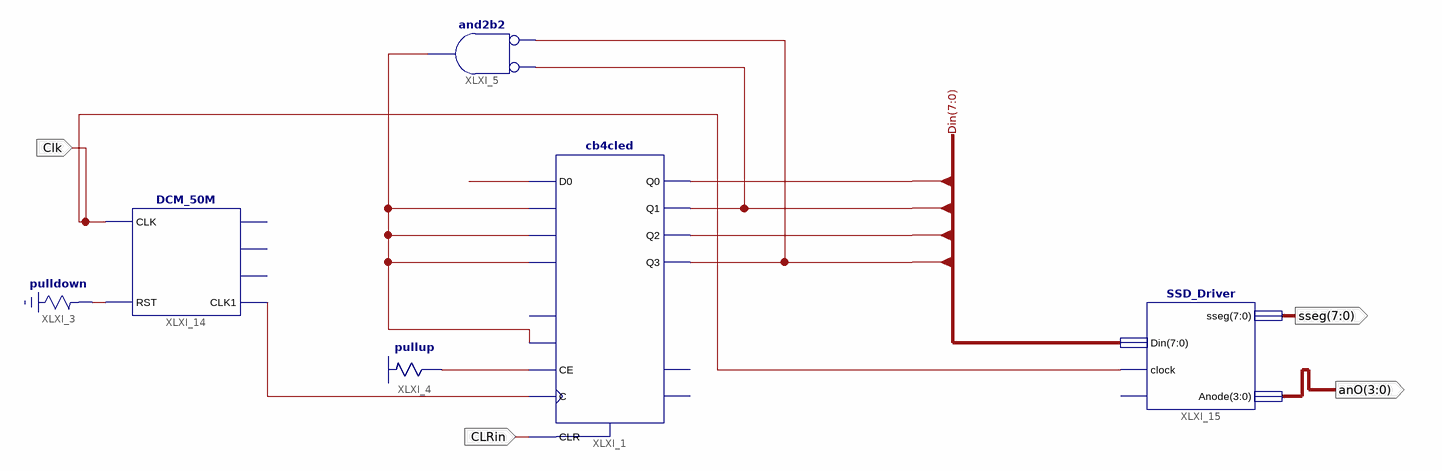
[diagram p0: schematic sheet 1]
// Xilinx ISE schematic Lab8_Experiment6.sch (spartan3e) as structural Verilog: 6 symbols, 4 ports
module Lab8_Experiment6 (
  input  CLRin,
  input  Clk,
  output [7:0] sseg,
  output [3:0] anO
);

  wire XLXN_2, XLXN_5, XLXN_6, XLXN_15, XLXN_23;
  wire [7:0] Din;

  cb4cled XLXI_1 (
    .C(XLXN_23), .CE(XLXN_5), .CLR(CLRin), .D0(XLXN_6), .D1(XLXN_15), .D2(XLXN_15), .D3(XLXN_15),
    .L(XLXN_15), .Q0(Din[0]), .Q1(Din[1]), .Q2(Din[2]), .Q3(Din[3]));  // open: UP, CEO, TC
  \pulldown  XLXI_3 (.O(XLXN_2));
  \pullup  XLXI_4 (.O(XLXN_5));
  and XLXI_5 (XLXN_15, ~Din[3], ~Din[1]);  // and2b2
  DCM_50M XLXI_14 (.CLK(Clk), .RST(XLXN_2), .CLK1(XLXN_23));  // open: CLK1M, CLK10k, CLK1k
  SSD_Driver XLXI_15 (.Din(Din), .clock(Clk), .sseg(sseg), .Anode(anO));  // open: ButtonEn
endmodule
